# Altium schematic sheet Esquematico_MOSFET.SchDoc
size A4
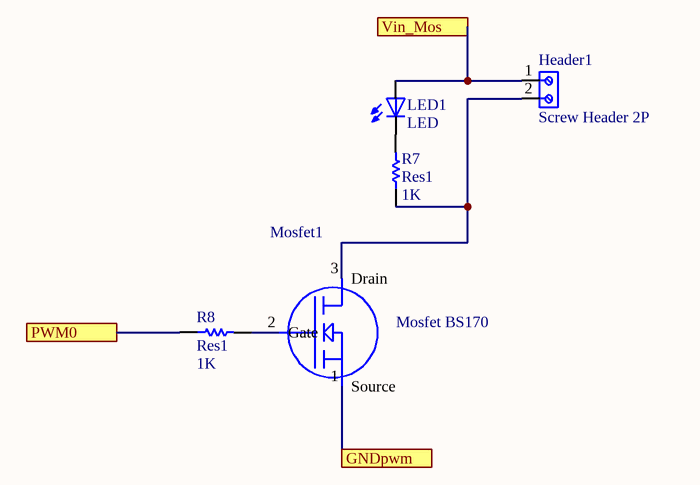
[diagram p0: Esquematico_MOSFET.SchDoc]

## Parts
Header1  Screw Header 2P  [Screw Header 2 Posicoes]
LED1  LED  [Led_THT]
Mosfet1  Mosfet BS170  [Mosfet BS170]
R7  Res1  value 1K  [AXIAL-0.3]
R8  Res1  value 1K  [AXIAL-0.3]

## Ports
GNDpwm, PWM0, Vin_Mos

## Nets
GNDpwm: Mosfet1.1(Source) ; port GNDpwm
PWM0: R8.1 ; port PWM0
Vin_Mos: Header1.1 LED1.A ; port Vin_Mos
NetHeader1_2: Header1.2 Mosfet1.3(Drain) R7.1
NetLED1_K: LED1.K(C) R7.2
NetMosfet1_2: Mosfet1.2(Gate) R8.2

## Library data of the parts
R7 R8 = Res1: Resistor; Published: 8-Jun-2000; LatestRevisionDate: 17-Jul-2002; LatestRevisionNote: Re-released for DXP Platform.; PackageReference: AXIAL-0.3; Publisher: Altium Limited; PackageDescription: Axial Device, Thru-Hole; 2 Leads; 0.3 in Pin Spacing